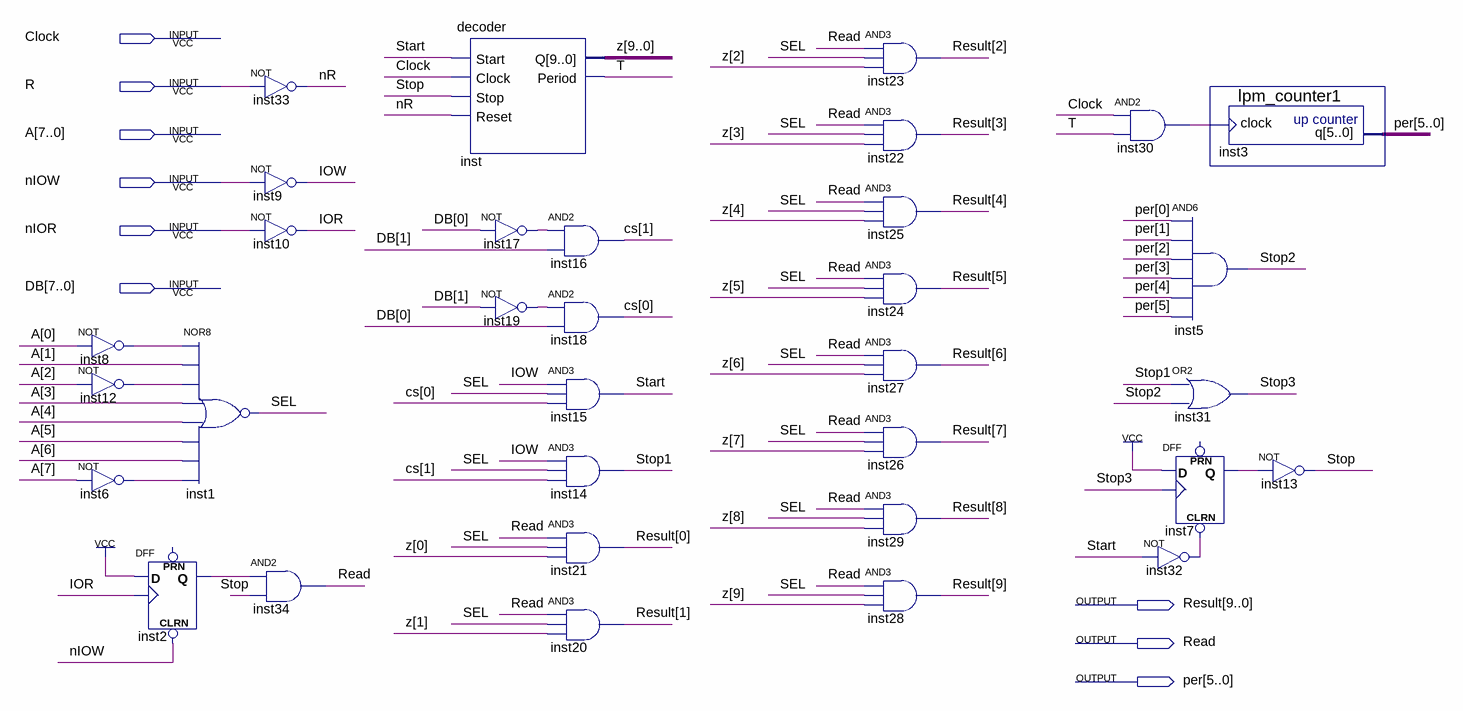
[diagram p0: schematic sheet]
// Quartus schematic interface.bdf as structural Verilog: 33 symbols, 9 pins
module \interface  (
  input  Clock,
  input  R,
  input  [7:0] A,
  input  nIOW,
  input  nIOR,
  input  [7:0] DB,
  output [9:0] Result,
  output Read,
  output [5:0] per
);

  wire inst2_q, inst6_out, inst7_q, inst8_out, inst12_out, inst17_out, inst19_out, inst30_out, inst32_out,
       IOR, IOW, nR, SEL, Start, Stop, Stop1, Stop2, Stop3, T;
  wire [1:0] cs;
  wire [9:0] z;

  not inst8 (inst8_out, A[0]);
  not inst12 (inst12_out, A[2]);
  not inst6 (inst6_out, A[7]);
  DFF inst2 (.CLRN(nIOW), .CLK(IOR), .D(1'b1), .Q(inst2_q));  // open: PRN
  nor inst1 (SEL, inst8_out, A[1], inst12_out, A[3], A[4], A[5], A[6], inst6_out);
  not inst33 (nR, R);
  not inst9 (IOW, nIOW);
  not inst10 (IOR, nIOR);
  and inst34 (Read, inst2_q, Stop);
  decoder inst (.Start(Start), .Clock(Clock), .Stop(Stop), .Reset(nR), .Q(z), .Period(T));
  and inst16 (cs[1], inst17_out, DB[1]);
  not inst17 (inst17_out, DB[0]);
  and inst18 (cs[0], inst19_out, DB[0]);
  not inst19 (inst19_out, DB[1]);
  and inst15 (Start, IOW, SEL, cs[0]);
  and inst14 (Stop1, IOW, SEL, cs[1]);
  and inst21 (Result[0], Read, SEL, z[0]);
  and inst20 (Result[1], Read, SEL, z[1]);
  and inst23 (Result[2], Read, SEL, z[2]);
  and inst22 (Result[3], Read, SEL, z[3]);
  and inst25 (Result[4], Read, SEL, z[4]);
  and inst24 (Result[5], Read, SEL, z[5]);
  and inst27 (Result[6], Read, SEL, z[6]);
  and inst26 (Result[7], Read, SEL, z[7]);
  and inst29 (Result[8], Read, SEL, z[8]);
  and inst28 (Result[9], Read, SEL, z[9]);
  and inst30 (inst30_out, Clock, T);
  DFF inst7 (.CLRN(inst32_out), .CLK(Stop3), .D(1'b1), .Q(inst7_q));  // open: PRN
  not inst32 (inst32_out, Start);
  lpm_counter1 inst3 (.clock(inst30_out), .q(per));
  and inst5 (Stop2, per[0], per[1], per[2], per[3], per[4], per[5]);
  or inst31 (Stop3, Stop1, Stop2);
  not inst13 (Stop, inst7_q);
endmodule
